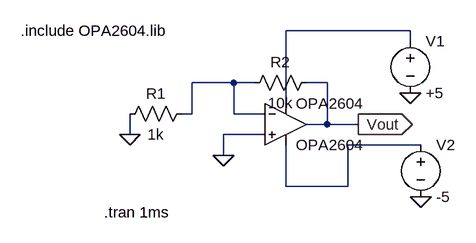
[diagram p0: schematic Opa2604OffsetVoltageTest.asc]
Opa2604OffsetVoltageTest.asc, the LTspice schematic file:
Version 4
SHEET 1 880 680
WIRE 416 16 224 16
WIRE 416 32 416 16
WIRE 144 96 80 96
WIRE 176 96 144 96
WIRE 288 96 256 96
WIRE 224 128 224 16
WIRE 80 144 80 96
WIRE 80 144 64 144
WIRE 144 144 144 96
WIRE 192 144 144 144
WIRE 288 160 288 96
WIRE 288 160 256 160
WIRE 336 160 288 160
WIRE -16 176 -16 144
WIRE 192 176 128 176
WIRE 432 192 320 192
WIRE 128 208 128 176
WIRE 224 256 224 192
WIRE 320 256 320 192
WIRE 320 256 224 256
FLAG 128 208 0
FLAG 416 112 0
FLAG 432 272 0
FLAG 336 160 Vout
IOPIN 336 160 Out
FLAG -16 176 0
SYMBOL OpAmps\\opamp2 224 96 R0
SYMATTR InstName OPA2604
SYMATTR Value OPA2604
SYMBOL voltage 416 16 R0
SYMATTR InstName V1
SYMATTR Value +5
SYMBOL voltage 432 176 R0
SYMATTR InstName V2
SYMATTR Value -5
SYMBOL res 80 128 R90
WINDOW 0 0 56 VBottom 2
WINDOW 3 32 56 VTop 2
SYMATTR InstName R1
SYMATTR Value 1k
SYMBOL res 272 80 R90
WINDOW 0 0 56 VBottom 2
WINDOW 3 32 56 VTop 2
SYMATTR InstName R2
SYMATTR Value 10k
TEXT -184 16 Left 2 !.include OPA2604.lib
TEXT -56 296 Left 2 !.tran 1ms

The netlist it stands for:
* Opa2604OffsetVoltageTest.asc
XOPA2604 0 N002 N001 N003 Vout OPA2604  ; pins In+ In- V+ V- OUT
V1 N001 0 +5
V2 N003 0 -5
R1 N002 0 1k
R2 Vout N002 10k
.include OPA2604.lib
.tran 1ms
.backanno
.end